# EAGLE design MacroPad (EAGLE 9.4.0)
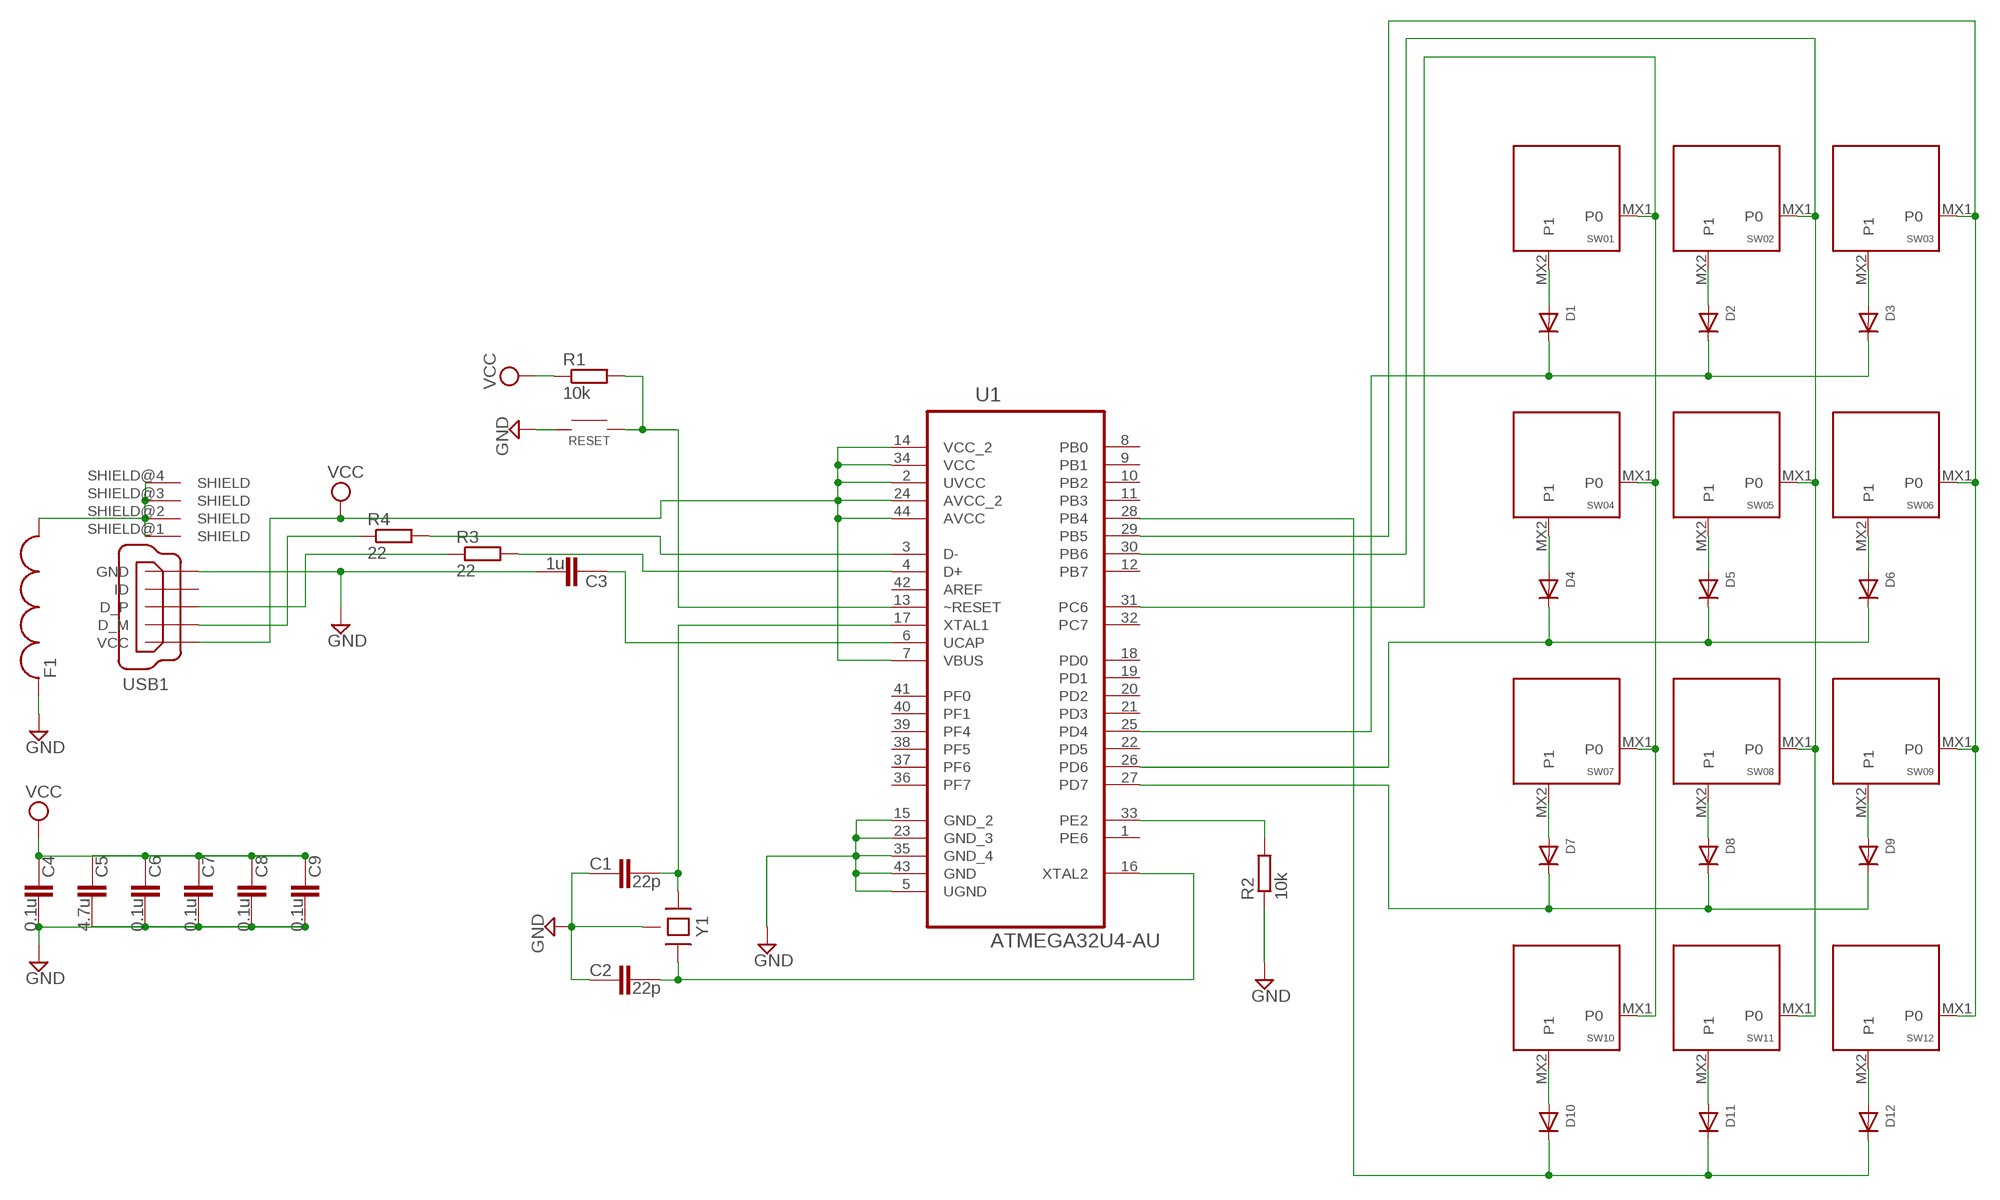
[diagram p0: schematic, sheet 1]

## Parts
C1  22p  CAPACITOR-0603  [C0603]
C2  22p  CAPACITOR-0603  [C0603]
C3  1u  CAPACITOR-0603  [C0603]
C4  0.1u  CAPACITOR-0603  [C0603]
C5  4.7u  CAPACITOR-0603  [C0603]
C6  0.1u  CAPACITOR-0603  [C0603]
C7  0.1u  CAPACITOR-0603  [C0603]
C8  0.1u  CAPACITOR-0603  [C0603]
C9  0.1u  CAPACITOR-0603  [C0603]
D1  DIODEDO-1N4148  [DO-1N4148]
D2  DIODEDO-1N4148  [DO-1N4148]
D3  DIODEDO-1N4148  [DO-1N4148]
D4  DIODEDO-1N4148  [DO-1N4148]
D5  DIODEDO-1N4148  [DO-1N4148]
D6  DIODEDO-1N4148  [DO-1N4148]
D7  DIODEDO-1N4148  [DO-1N4148]
D8  DIODEDO-1N4148  [DO-1N4148]
D9  DIODEDO-1N4148  [DO-1N4148]
D10  DIODEDO-1N4148  [DO-1N4148]
D11  DIODEDO-1N4148  [DO-1N4148]
D12  DIODEDO-1N4148  [DO-1N4148]
F1  FERRITE-0805  [F0805]
R1  10k  RESISTOR-0603  [R0603]
R2  10k  RESISTOR-0603  [R0603]
R3  22  RESISTOR-0603  [R0603]
R4  22  RESISTOR-0603  [R0603]
RESET  SWITCH-SMD-EVQP-P2602W  [SWITCH-SMD-EVQP-P2602W]
SW01  KEYSWITCH-PLAIN-MX-1U  [MX-1U]
SW02  KEYSWITCH-PLAIN-MX-1U  [MX-1U]
SW03  KEYSWITCH-PLAIN-MX-1U  [MX-1U]
SW04  KEYSWITCH-PLAIN-MX-1U  [MX-1U]
SW05  KEYSWITCH-PLAIN-MX-1U  [MX-1U]
SW06  KEYSWITCH-PLAIN-MX-1U  [MX-1U]
SW07  KEYSWITCH-PLAIN-MX-1U  [MX-1U]
SW08  KEYSWITCH-PLAIN-MX-1U  [MX-1U]
SW09  KEYSWITCH-PLAIN-MX-1U  [MX-1U]
SW10  KEYSWITCH-PLAIN-MX-1U  [MX-1U]
SW11  KEYSWITCH-PLAIN-MX-1U  [MX-1U]
SW12  KEYSWITCH-PLAIN-MX-1U  [MX-1U]
U1  ATMEGA32U4-AU  [QFP80P1200X1200X120-44N]
USB1  USB_CONN-MINI-FEMALE  [UX60-MB-5S8]
Y1  CRYSTAL-4PIN-3.2X5  [CRYSTAL-3.2X5]

## Nets
GND: C1.1 C2.1 C3.2 C4.2 C5.2 C6.2 C7.2 C8.2 C9.2 F1.1 R2.1 RESET.1A RESET.1B U1.5(UGND) U1.15(GND_2) U1.23(GND_3) U1.35(GND_4) U1.43(GND) USB1.GND Y1.2(GND) Y1.4(GND)
N$1: C2.2 U1.16(XTAL2) Y1.3
N$2: C1.2 U1.17(XTAL1) Y1.1
N$3: R1.2 RESET.2A RESET.2B U1.13(~RESET)
N$4: R2.2 U1.33(PE2)
N$5: R4.1 USB1.D-(D_M)
N$6: R4.2 U1.3(D-)
N$7: R3.1 USB1.D+(D_P)
N$8: R3.2 U1.4(D+)
N$9: D1.A SW01.MX2(P1)
N$10: SW01.MX1(P0) SW04.MX1(P0) SW07.MX1(P0) SW10.MX1(P0) U1.31(PC6)
N$11: F1.2 USB1.SHIELD@1(SHIELD) USB1.SHIELD@2(SHIELD) USB1.SHIELD@3(SHIELD) USB1.SHIELD@4(SHIELD)
N$12: D2.A SW02.MX2(P1)
N$14: D1.C D2.C D3.C U1.25(PD4)
N$15: D3.A SW03.MX2(P1)
N$16: SW03.MX1(P0) SW06.MX1(P0) SW09.MX1(P0) SW12.MX1(P0) U1.29(PB5)
N$18: D4.A SW04.MX2(P1)
N$21: D5.A SW05.MX2(P1)
N$24: D6.A SW06.MX2(P1)
N$26: D4.C D5.C D6.C U1.26(PD6)
N$27: D7.A SW07.MX2(P1)
N$30: D8.A SW08.MX2(P1)
N$32: D7.C D8.C D9.C U1.27(PD7)
N$33: D9.A SW09.MX2(P1)
N$36: D10.A SW10.MX2(P1)
N$38: D10.C D11.C D12.C U1.28(PB4)
N$39: D11.A SW11.MX2(P1)
N$40: SW02.MX1(P0) SW05.MX1(P0) SW08.MX1(P0) SW11.MX1(P0) U1.30(PB6)
N$42: D12.A SW12.MX2(P1)
UCAP: C3.1 U1.6(UCAP)
VCC: C4.1 C5.1 C6.1 C7.1 C8.1 C9.1 R1.1 U1.2(UVCC) U1.7(VBUS) U1.14(VCC_2) U1.24(AVCC_2) U1.34(VCC) U1.44(AVCC) USB1.VCC
Unconnected: U1.1(PE6) U1.8(PB0) U1.9(PB1) U1.10(PB2) U1.11(PB3) U1.12(PB7) U1.18(PD0) U1.19(PD1) U1.20(PD2) U1.21(PD3) U1.22(PD5) U1.32(PC7) U1.36(PF7) U1.37(PF6) U1.38(PF5) U1.39(PF4) U1.40(PF1) U1.41(PF0) U1.42(AREF) USB1.ID

## Library data of the parts
C1 C2 = Components:CAPACITOR; MPN: 04025A220JAT2A; OC_NEWARK: 96M1143
C3-C9 = Components:CAPACITOR; OC_NEWARK: unknown
D1-D12 = adafruit:DIODE: Diode SMADIODE - SMA Surface Mount Package 20V 1A Schottky Diode Digikey: 641-1014-6-ND DO-1N4148 - Through Hole Small Current Diode SOD-123 20V 1 A (.5mV Vf) Schottky Diode - Digikey: MBRX120TPMSCT-ND SOD-323 10V 570mA (.38mV Vf, 3ns) Schottky Diode - Digikey: ZLLS410CT-ND SOD-523 30V 30mA Schottky Diode (RB751S-40TE61) - Digikey: RB751S-40TE61CT-ND SOT23-R/W - SOT23 Package (R = Solder Paste/Reflow Ovens, W = Hand-Soldering) BAT54Film 40V 300mA - Digikey: 497-7162-1-ND
F1 = USB:FERRITE; OC_NEWARK: unknown
R1-R4 = Components:RESISTOR; OC_NEWARK: unknown
RESET = Hardware:SWITCH-SMD; OC_NEWARK: unknown
SW01-SW09 SW10-SW12 = Keyboard:KEYSWITCH-PLAIN; OC_NEWARK: unknown
U1 = ATMEGA32U4-AU:ATMEGA32U4-AU: 8-bit Microcontroller with ISP Flash and USB Controller; AVAILABILITY: Unavailable; DESCRIPTION: MCU 8-bit ATmega AVR RISC 32KB Flash 3.3V/5V 44-Pin TQFP; MF: Microchip; MP: ATMEGA32U4-AU; PACKAGE: TQFP-44 Microchip; PRICE: None
USB1 = Controller:USB_CONN; OC_NEWARK: unknown
Y1 = Controller:CRYSTAL-4PIN

## Board
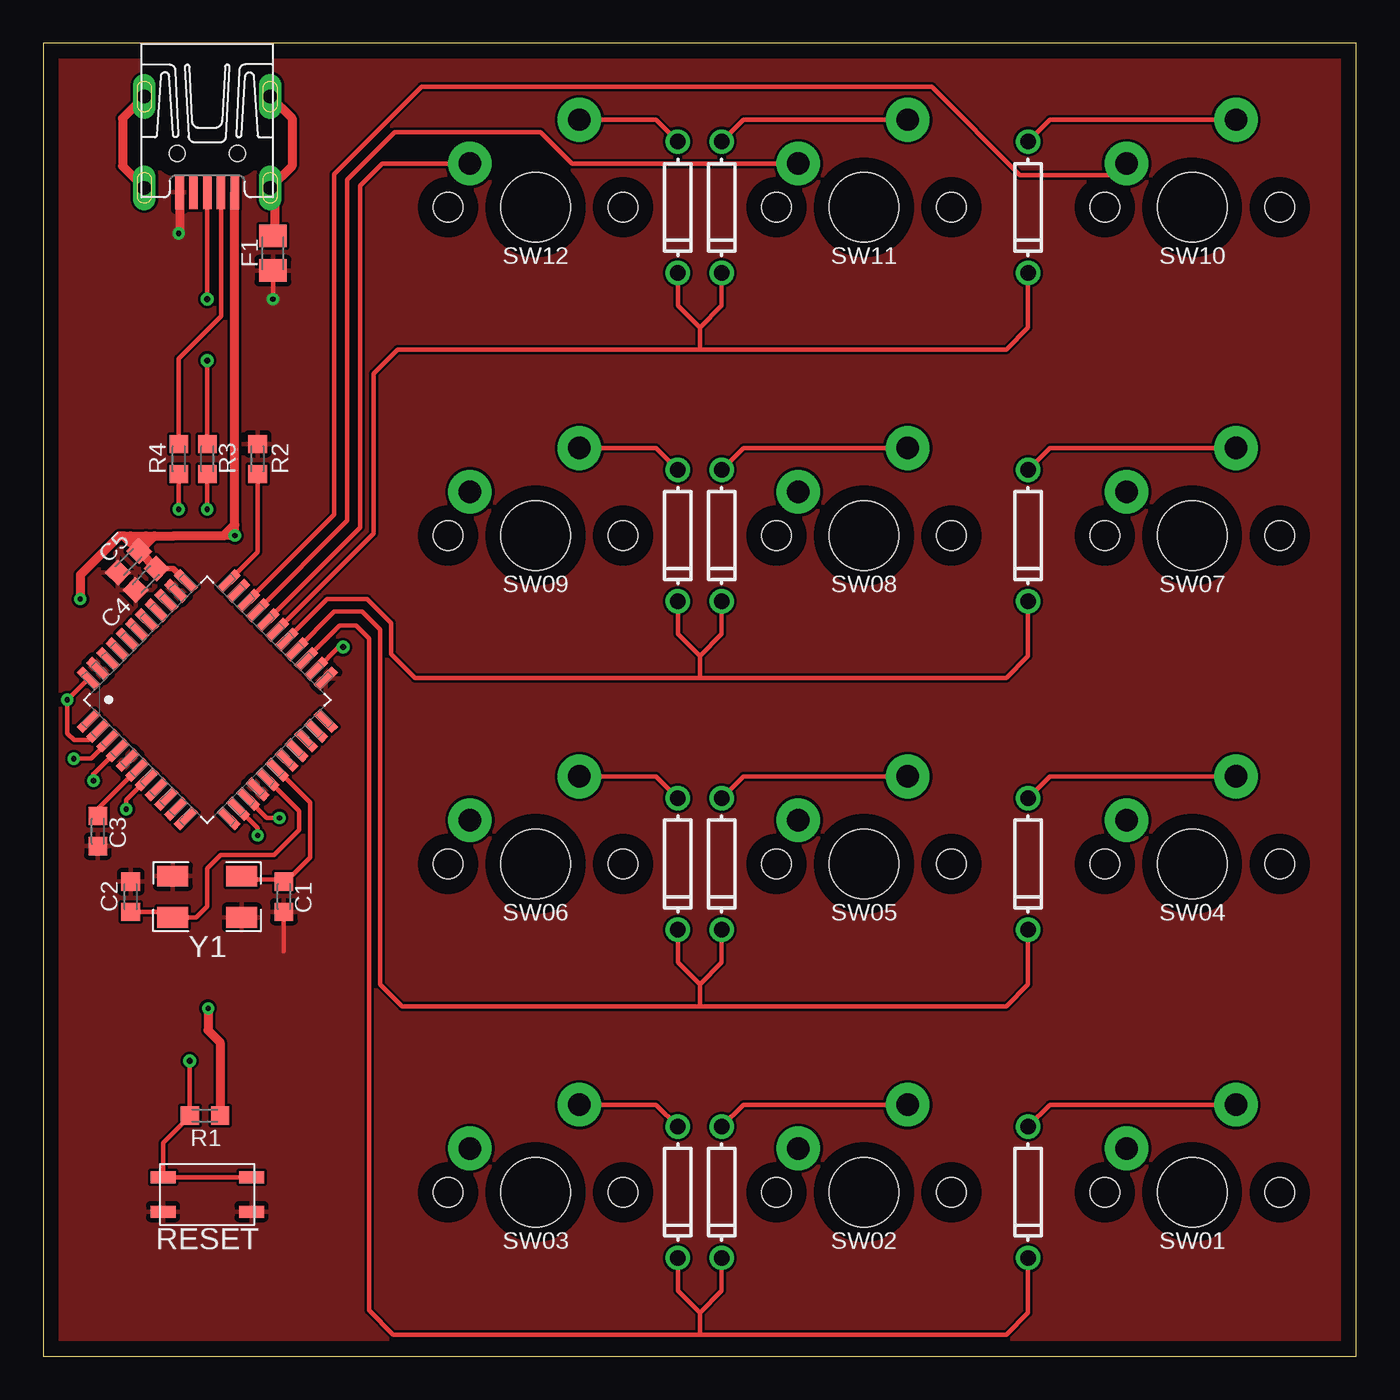
[diagram p1: board, top side]
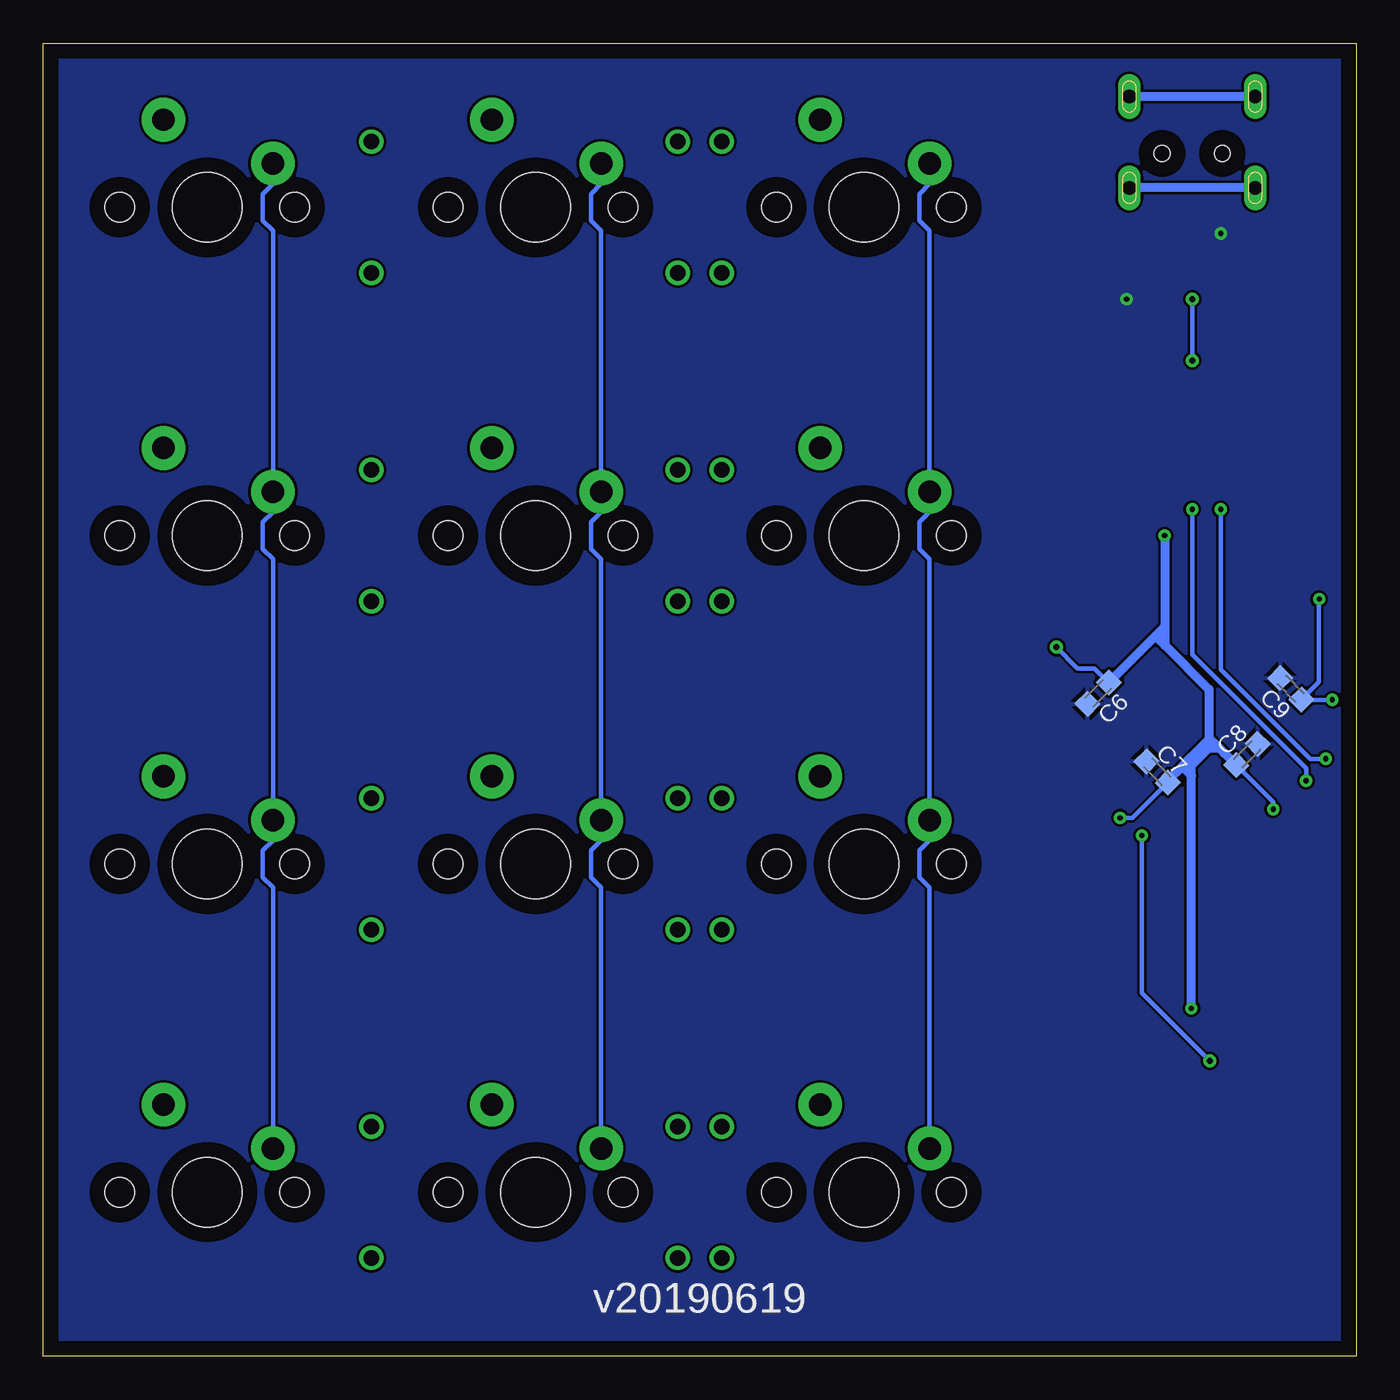
[diagram p2: board, bottom side, seen from below]

Size 76.2 x 76.2 mm. Coordinates in mm from the lower left corner, seen from the top.
Outline: 0,0 76.2,0 76.2,76.2 0,76.19 0,0
Copper layers (1*16): Top 0.035mm / dielectric 1.5mm / Bottom 0.035mm
Design rules "default *": minimum track width 6mil, minimum drill 0.35mm, track to track 6mil, track to pad 6mil, pad to pad 6mil, via to via 6mil, smd to smd 6mil, copper to edge 35mil, drill to drill 6mil, minimum pad ring 10mil, minimum via ring 8mil, stop-mask expansion 4mil, vias tented up to drill 0mil, thermal gap 10mil

### Footprints (pad centres in the part's own frame; a part is rotated, then mirrored left to right if it is on the bottom)
C0603 = smd 1.05 x 1.08: 1 -0.875,0; 2 0.875,0
DO-1N4148 = drill 0.9: A -3.81,0; C 3.81,0
F0805 = smd 1.3 x 1.6: 1 -1,0; 2 1,0
R0603 = smd 1.05 x 1.08: 1 -0.875,0; 2 0.875,0
SWITCH-SMD-EVQP-P2602W = smd 1.45 x 0.7: 1A -2.57,-1; 1B 2.57,-1; 2A -2.57,1; 2B 2.57,1
MX-1U = drill 1.3 pad 2.54: MX1 -3.81,2.54; MX2 2.54,5.08 | hole 4: 0,0 | hole 1.7: -5.08,0; 5.08,0
QFP80P1200X1200X120-44N = smd 1.473 x 0.508: 1 -5.74,3.988; 2 -5.74,3.2; 3 -5.74,2.388; 4 -5.74,1.6; 5 -5.74,0.787; 6 -5.74,0; 7 -5.74,-0.787; 8 -5.74,-1.6; 9 -5.74,-2.388; 10 -5.74,-3.2; 11 -5.74,-3.988; 23 5.74,-3.988; 24 5.74,-3.2; 25 5.74,-2.388; 26 5.74,-1.6; 27 5.74,-0.787; 28 5.74,0; 29 5.74,0.787; 30 5.74,1.6; 31 5.74,2.388; 32 5.74,3.2; 33 5.74,3.988 | smd 0.508 x 1.473: 12 -3.988,-5.74; 13 -3.2,-5.74; 14 -2.388,-5.74; 15 -1.6,-5.74; 16 -0.787,-5.74; 17 0,-5.74; 18 0.787,-5.74; 19 1.6,-5.74; 20 2.388,-5.74; 21 3.2,-5.74; 22 3.988,-5.74; 34 3.988,5.74; 35 3.2,5.74; 36 2.388,5.74; 37 1.6,5.74; 38 0.787,5.74; 39 0,5.74; 40 -0.787,5.74; 41 -1.6,5.74; 42 -2.388,5.74; 43 -3.2,5.74; 44 -3.988,5.74
UX60-MB-5S8 = smd 2 x 0.5: D+ 8.65,0; D- 8.65,0.8; GND 8.65,-1.6; ID 8.65,-0.8; VCC 8.65,1.6 | drill 0.8 long: SHIELD@1 3.1,-3.65; SHIELD@2 3.1,3.65; SHIELD@3 8.4,-3.65; SHIELD@4 8.4,3.65 | hole 0.9: 6.4,-1.75; 6.4,1.75
CRYSTAL-3.2X5 = smd 1.8 x 1.2: 1 -2,-1.2; 2 2,-1.2; 3 2,1.2; 4 -2,1.2

### Placement (x,y rotation side)
C1  13.97,26.67 90 top
C2  5.08,26.67 270 top
C3  3.17,30.48 270 top
C4  5.97,45.09 226 top
C5  4.95,46.1 225 top
C6  14.99,38.48 225 bottom
C7  11.56,33.91 135 bottom
C8  6.35,34.92 45 bottom
C9  3.81,38.73 135 bottom
D1  57.15,9.53 270 top
D2  39.37,9.53 270 top
D3  36.83,9.53 270 top
D4  57.15,28.57 270 top
D5  39.37,28.57 270 top
D6  36.83,28.57 270 top
D7  57.15,47.62 270 top
D8  39.37,47.62 270 top
D9  36.83,47.62 270 top
D10  57.15,66.67 270 top
D11  39.37,66.67 270 top
D12  36.83,66.67 270 top
F1  13.34,64.01 90 top
R1  9.4,13.97 180 top
R2  12.45,52.07 270 top
R3  9.53,52.07 270 top
R4  7.87,52.07 270 top
RESET  9.53,9.4 0 top
SW01  66.67,9.53 0 top
SW02  47.62,9.53 0 top
SW03  28.57,9.53 0 top
SW04  66.67,28.57 0 top
SW05  47.62,28.57 0 top
SW06  28.57,28.57 0 top
SW07  66.67,47.62 0 top
SW08  47.62,47.62 0 top
SW09  28.57,47.62 0 top
SW10  66.67,66.67 0 top
SW11  47.62,66.67 0 top
SW12  28.57,66.67 0 top
U1  9.53,38.1 45 top
USB1  9.53,76.2 270 top
Y1  9.53,26.67 180 top

### Tracks (layer width: path | path; a pad name or v marks a point on that pad's centre or on a via)
GND  (via drill 0.3)
  Top 0.254: C5.2 4.33,45.04 | C2.1 5.13,27.59 | F1.1 v13.34,61.34 | C1.1 13.97,23.5
  Top 0.508: USB1.GND 7.92,65.2 v7.87,65.15
  Bottom 0.254: C7.2 12.18,34.18
  pour Top: -1.27,77.47 -1.27,-1.27 77.47,-1.27 77.47,77.47
  pour Bottom: -1.27,77.47 77.47,77.47 77.47,-1.27 -1.27,-1.27
N$1
  Top 0.254: C2.2 7.2,25.8 Y1.3 8.89,25.47 9.53,26.11 9.53,28.32 10.3,29.09 13.39,29.09 14.86,30.56 14.86,31.65 U1.16
N$2
  Top 0.254: 14.22,27.69 15.49,28.96 15.49,32.13 U1.17 | 14.22,27.69 14.08,27.55 C1.2 | Y1.1 11.71,27.69 14.22,27.69
N$3  (via drill 0.3, 0.35)
  Top 0.254: RESET.2B RESET.2A 6.96,12.4 R1.2 8.51,13.98 v8.51,17.14 | v12.45,30.23 12.45,30.65 U1.13
  Bottom 0.254: v12.45,30.23 12.45,21.08 v8.51,17.14
N$4
  Top 0.254: R2.2 12.45,46.66 U1.33
N$5
  Top 0.254: R4.1 7.87,57.9 9.28,59.3 9.53,59.55 10.32,60.35 USB1.D-
N$6  (via drill 0.3)
  Top 0.254: R4.2 v7.87,49.15 | v1.78,34.67 1.8,34.69 2.79,34.69 3.78,35.67 U1.3
  Bottom 0.254: v7.87,49.15 7.87,39.86 4.83,36.82 2.68,34.67 v1.78,34.67
N$7  (via drill 0.35)
  Top 0.254: R3.1 v9.53,57.78 | v9.53,61.34 USB1.D+
  Bottom 0.254: v9.53,57.78 v9.53,61.34
N$8  (via drill 0.3)
  Top 0.254: R3.2 v9.53,49.15 | 2.92,33.78 v2.92,33.4 2.92,33.76 U1.4
  Bottom 0.254: v9.53,49.15 9.53,40.73 2.92,34.12 v2.92,33.4
N$9
  Top 0.254: SW01.MX2 58.42,14.61 D1.A
N$10
  Top 0.254: SW10.MX1 62.19,68.54 56.68,68.54 51.56,73.66 21.97,73.66 16.89,68.58 16.89,48.84 U1.31
  Bottom 0.254: SW10.MX1 62.87,68.04 63.46,67.45 63.46,65.9 62.87,65.31 SW07.MX1 62.87,48.99 63.46,48.4 63.46,46.85 62.87,46.26 SW04.MX1 62.87,29.94 63.46,29.35 63.46,27.8 62.87,27.21 SW01.MX1
N$11
  Top 0.508: USB1.SHIELD@3 4.61,69.07 4.61,71.83 USB1.SHIELD@1 | USB1.SHIELD@2 14.45,71.83 14.45,69.07 USB1.SHIELD@4 13.43,67.55 13.43,65.1 F1.2
  Bottom 0.508: USB1.SHIELD@3 USB1.SHIELD@4 | USB1.SHIELD@1 USB1.SHIELD@2
N$12
  Top 0.254: SW02.MX2 40.64,14.61 D2.A
N$14
  Top 0.254: 38.1,1.27 20.32,1.27 18.92,2.67 18.92,41.66 18.16,42.42 17.22,42.42 U1.25 | 38.1,1.27 55.88,1.27 57.15,2.54 D1.C | D3.C 36.83,3.81 38.1,2.54 | 38.1,2.54 39.37,3.81 D2.C | 38.1,2.54 38.1,1.27
N$15
  Top 0.254: SW03.MX2 35.56,14.61 D3.A
N$16
  Top 0.254: SW12.MX1 19.68,69.22 18.39,67.92 18.39,48.08 U1.29
  Bottom 0.254: SW12.MX1 24.77,68.04 25.36,67.45 25.36,65.9 24.77,65.31 SW09.MX1 24.77,48.99 25.36,48.4 25.36,46.85 24.77,46.26 SW06.MX1 24.77,29.94 25.36,29.35 25.36,27.8 24.77,27.21 SW03.MX1
N$18
  Top 0.254: SW04.MX2 58.42,33.66 D4.A
N$21
  Top 0.254: SW05.MX2 40.64,33.66 D5.A
N$24
  Top 0.254: SW06.MX2 35.56,33.66 D6.A
N$26
  Top 0.254: 38.1,20.32 55.88,20.32 57.15,21.59 D4.C | D6.C 36.83,22.86 38.1,21.59 | 38.1,21.59 38.1,20.32 | D5.C 39.37,22.86 38.1,21.59 | 38.1,20.32 20.83,20.32 19.56,21.59 19.56,42.16 18.52,43.2 16.89,43.2 U1.26
N$27
  Top 0.254: SW07.MX2 58.42,52.7 D7.A
N$30
  Top 0.254: SW08.MX2 40.64,52.7 D8.A
N$32
  Top 0.254: 38.1,39.37 55.88,39.37 57.15,40.64 D7.C | D9.C 36.83,41.91 38.1,40.64 | 38.1,40.64 39.37,41.91 D8.C | 38.1,40.64 38.1,39.37 | 38.1,39.37 21.59,39.37 20.19,40.77 20.19,42.55 18.8,43.94 16.48,43.94 U1.27
N$33
  Top 0.254: SW09.MX2 35.56,52.7 D9.A
N$36
  Top 0.254: D10.A 58.42,71.75 SW10.MX2
N$38
  Top 0.254: 38.1,58.42 55.88,58.42 57.15,59.69 D10.C | D12.C 36.83,60.96 38.1,59.69 | D11.C 39.37,60.96 38.1,59.69 | 38.1,59.69 38.1,58.42 | 38.1,58.42 20.57,58.42 19.18,57.02 19.18,47.75 U1.28
N$39
  Top 0.254: D11.A 40.64,71.75 SW11.MX2
N$40
  Top 0.254: SW11.MX1 30.68,69.22 28.88,71.02 20.41,71.02 17.65,68.27 17.65,48.49 U1.30
  Bottom 0.254: SW11.MX1 43.81,68.04 44.41,67.45 44.41,65.9 43.81,65.31 SW08.MX1 43.81,48.99 44.41,48.4 44.41,46.85 43.81,46.26 SW05.MX1 43.81,29.94 44.41,29.35 44.41,27.8 43.81,27.21 SW02.MX1
N$42
  Top 0.254: SW12.MX2 35.56,71.75 D12.A
UCAP
  Top 0.254: U1.6 3.17,31.75 C3.1
VCC  (via drill 0.3, 0.35)
  Top 0.254: v17.4,41.15 17.14,41.15 15.89,39.9 U1.24 | v4.83,31.75 4.83,32.29 U1.7 | v13.72,31.24 12.98,31.24 11.9,32.33 U1.14 | U1.44 2.64,39.34 v1.4,38.1 1.41,38.09 1.41,36.15 1.81,35.75 2.65,35.75 U1.2
  Top 0.305: C4.1 7.55,45.71 U1.34
  Top 0.508: 11.12,48.26 USB1.VCC | 6.46,47.61 C5.1 | v2.16,43.94 2.16,45.34 4.43,47.61 4.68,47.61 | 4.68,47.61 5.08,47.61 | 5.08,47.61 6.46,47.61 | 6.46,47.61 7.59,47.61 7.58,47.62 10.49,47.62 | C4.1 C5.1 | v9.57,20.19 9.57,18.92 10.27,18.22 R1.1 | C5.1 5.57,47.21 5.97,47.61 | 10.49,47.62 11.12,48.26 | 11.12,48.26 v11.12,47.62 10.49,47.62 | C5.1 4.68,47.61 | C5.1 5.57,47.12 5.08,47.61
  Bottom 0.254: C6.1 15.19,39.92 16.18,39.92 v17.4,41.15 | v2.16,43.94 2.17,43.93 2.17,39.13 C9.1 3.17,38.1 v1.4,38.1 | v4.83,31.75 4.83,32.16 C8.1 | C7.1 12.99,31.24 v13.72,31.24
  Bottom 0.508: v11.12,47.62 11.12,42.34 | 11.63,41.78 11.12,41.27 | 11.12,41.27 8.56,38.71 8.56,35.89 | 8.56,35.89 8.05,35.39 | C7.1 10.94,33.42 10.11,34.24 | 10.11,34.24 9.57,34.78 9.57,34.29 | 8.97,35.39 8.56,35.8 | v9.57,20.19 9.57,33.7 | 9.57,33.7 9.57,34.29 | C6.1 11.12,42.34 | 7.92,35.26 C8.1 7.67,35.01 | 7.92,35.26 8.05,35.39 | 8.05,35.39 8.97,35.39 | 11.12,42.34 11.12,41.27 | 8.56,35.67 8.56,35.8 | 8.56,35.89 8.56,35.8 | 8.97,35.39 10.11,34.24 | 7.92,35.26 8.6,35.26 9.57,34.29 | 9.57,33.7 10.11,34.24

### Text on the board
bPlace: v20190619